# Altium schematic sheet EV75E52A_R3_4-PIC_USB.SchDoc
size Tabloid; DocumentNumber: 4; SheetNumber: 4; PageSetup: Record=PageOptions|CenterHorizontal=True|CenterVertical=True|PrintScale=1.02|XCorrection=1.00|YCorrection=1.00|PrintKind=0|BorderSize=5000000|LeftOffset=0|BottomOffset=0|Orientation=2|PaperLength=1000|PaperWidth=1000|Scale=100|PaperSource=15|PrintQuality=-3|MediaType=1|DitherType=10|PrintScaleMode=1|PaperKind=11 x 17|PaperIndex=119; PageTitle: PIC; SheetTitle: PIC; DocumentFullPathAndName: //depot_np_hweng_boards/ung_hweng/UNG_8017_EVB-USB5926/
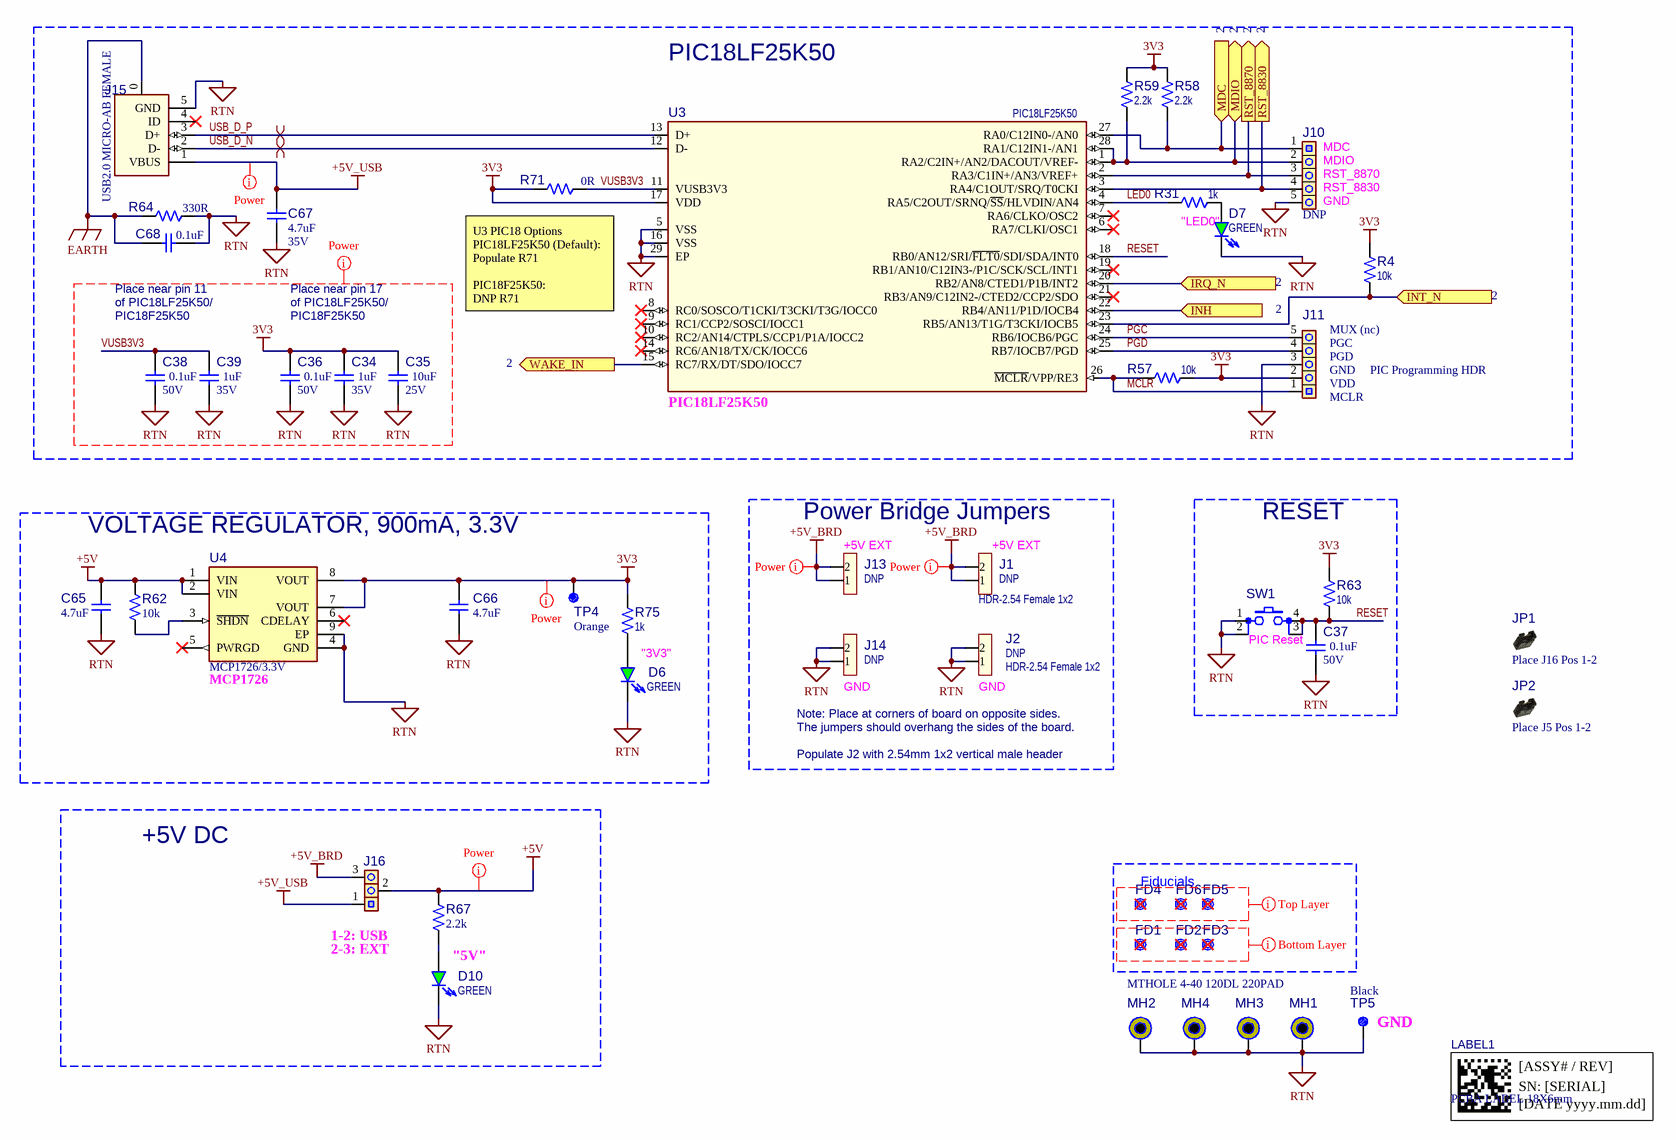
[diagram p0: EV75E52A_R3_4-PIC_USB.SchDoc]

## Parts
C34  value 1uF  Voltage: 35V  [CAP_C_0402]  (hidden comment: Capacitor NP)
C35  value 10uF  Voltage: 25V  [CAP_C_0603]  (hidden comment: Capacitor NP)
C36  value 0.1uF  Voltage: 50V  [CAP_C_0402]  (hidden comment: Capacitor NP)
C37  value 0.1uF  Voltage: 50V  [CAP_C_0402]  (hidden comment: Capacitor NP)
C38  value 0.1uF  Voltage: 50V  [CAP_C_0402]  (hidden comment: Capacitor NP)
C39  value 1uF  Voltage: 35V  [CAP_C_0402]  (hidden comment: Capacitor NP)
C65  value 4.7uF  [CAP_C_0402]  (hidden comment: Capacitor NP)
C66  value 4.7uF  [CAP_C_0402]  (hidden comment: Capacitor NP)
C67  value 4.7uF  Voltage: 35V  [CAP_C_0603]  (hidden comment: Capacitor NP)
C68  value 0.1uF  [CAP_C_0402]  (hidden comment: Capacitor NP)
D6  value GREEN  [LED_0603_GREEN]  (hidden comment: LED_green)
D7  value GREEN  [LED_0603_GREEN]  (hidden comment: LED_green)
D10  value GREEN  Legend Note: "5V"  [LED_0603_GREEN]  (hidden comment: LED_green)
FD1  FIDUCIAL ROUND  [FIDUCIAL_ROUND_1mm]  (value not drawn)  (no BOM)
FD2  FIDUCIAL ROUND  [FIDUCIAL_ROUND_1mm]  (value not drawn)  (no BOM)
FD3  FIDUCIAL ROUND  [FIDUCIAL_ROUND_1mm]  (value not drawn)  (no BOM)
FD4  FIDUCIAL ROUND  [FIDUCIAL_ROUND_1mm]  (value not drawn)  (no BOM)
FD5  FIDUCIAL ROUND  [FIDUCIAL_ROUND_1mm]  (value not drawn)  (no BOM)
FD6  FIDUCIAL ROUND  [FIDUCIAL_ROUND_1mm]  (value not drawn)  (no BOM)
J1  value HDR-2.54 Female 1x2  Populated: DNP  [HDR_F_2.54_1x2_RA]  (hidden comment: Header 1x2)
J2  value HDR-2.54 Female 1x2  Populated: DNP  [HDR_F_2.54_1x2_RA]  (hidden comment: Header 1x2)
J10  Populated: DNP  [HDR_M_2.54_1x5]  (hidden comment: Header 1x5)
J11  Header 1x5  [HDR_M_2.54_1x5]  (value not drawn)
J13  Populated: DNP  [HDR_M_2.54_1x2_RA]  (hidden comment: Header 1x2)
J14  Populated: DNP  [HDR_M_2.54_1x2_RA]  (hidden comment: Header 1x2)
J15  value USB2.0 MICRO-AB FEMALE  [CON_USB_Micro-AB_SMD_RA_HIR_ZX62-AB-5PA(11)]  (hidden comment: CON USB2.0 Mini_Micro)
J16  Header 1x3  [HDR_M_2.54_1x3]  (value not drawn)  (net tie)
JP1  BOM Notes: Place J16 Pos 1-2  [Jumper_W_Handle_Mechanical]  (hidden comment: Jumper Mechanical)  (mechanical)
JP2  BOM Notes: Place J5 Pos 1-2  [Jumper_W_Handle_Mechanical]  (hidden comment: Jumper Mechanical)  (mechanical)
LABEL1  value PCBA LABEL 18X6mm  [08-10015]  (hidden comment: 08-10015)
MH1  (no value)  [MTHOLE_4-40]  (no BOM)
MH2  (no value)  [MTHOLE_4-40]  (no BOM)
MH3  (no value)  [MTHOLE_4-40]  (no BOM)
MH4  (no value)  [MTHOLE_4-40]  (no BOM)
R4  value 10k  [RES_C_0402]  (hidden comment: Resistor)
R31  value 1k  [RES_C_0402]  (hidden comment: Resistor)
R57  value 10k  [RES_C_0402]  (hidden comment: Resistor)
R58  value 2.2k  [RES_C_0402]  (hidden comment: Resistor)
R59  value 2.2k  [RES_C_0402]  (hidden comment: Resistor)
R62  value 10k  [RES_C_0402]  (hidden comment: Resistor)
R63  value 10k  [RES_C_0402]  (hidden comment: Resistor)
R64  value 330R  [RES_C_0603]  (hidden comment: Resistor)
R67  value 2.2k  [RES_C_0603]  (hidden comment: Resistor)
R71  value 0R  [RES_C_0402]  (hidden comment: Resistor)
R75  value 1k  [RES_C_0402]  (hidden comment: Resistor)
SW1  Switch 4 Pin  [SW_TACT_SMD_CK_PTS810SJM]  (value not drawn)
TP4  value Orange  [CON_TP_TH_V_ORN_KEC_5003]  (hidden comment: Test Point)
TP5  value Black  Legend Notes: GND  [CON_TP_TH_V_BLK_KEC_5001]  (hidden comment: Test Point)
U3  value PIC18LF25K50  [QFN-28_6X6]  (hidden comment: PIC18(L)F2XK50 QFN-28)
U4  value MCP1726/3.3V  Legend Note: MCP1726  [DFN-8_3x3]  (hidden comment: MCP1726 FIX DFN-8)

## Blocks framed on the sheet
PIC18LF25K50: C34-C36 C38 C39 C67 C68 D7 J10 J11 J15 R4 R31 R57-R59 R64 R71 U3
VOLTAGE REGULATOR, 900mA, 3.3V: C65 C66 D6 R62 R75 TP4 U4
Power Bridge Jumpers: J1 J2 J13 J14
RESET: C37 R63 SW1
+5V DC: D10 J16 R67
Fiducials: FD1-FD6

## Ports
INH (in), INT_N (in), IRQ_N (in), MDC (in), MDIO (bidir), RST_8830 (out), RST_8870 (out), WAKE_IN (out)

## Nets
3V3: C34.2 C35.2 C36.2 C66.2 J11.2(P2) R4.1 R57.1 R58.2 R59.2 R63.1 R71.1 R75.2 TP4.1 U3.17(VDD) U4.7(VOUT) U4.8(VOUT)
+5V: C65.2 J16.2 R62.2 R67.1 U4.1(VIN) U4.2(VIN)
+5V_BRD: J1.1 J1.2 J13.1 J13.2 J16.3
+5V_USB: C67.2 J15.1(VBUS) J16.1
EARTH: C68.2 J15.0(SHLD) R64.2
RTN: C34.1 C35.1 C36.1 C37.1 C38.1 C39.1 C65.1 C66.1 C67.1 C68.1 D6.2(K) D7.2(K) D10.2(K) J2.1 J2.2 J10.5(P5) J11.3(P3) J14.1 J14.2 J15.5(GND) MH1.1 MH2.1 MH3.1 MH4.1 R64.1 SW1.1 SW1.2 TP5.1 U3.5(VSS) U3.16(VSS) U3.29(EP) U4.4(GND) U4.9(EP)
INH: U3.22(RB4/AN11/P1D/IOCB4) ; port INH
INT_N: R4.2 U3.23(RB5/AN13/T1G/T3CKI/IOCB5) ; port INT_N
IRQ_N: U3.20(RB2/AN8/CTED1/P1B/INT2) ; port IRQ_N
LED0: R31.2 U3.4(RA5/C2OUT/SRNQ/~{SS}/HLVDIN/AN4)
MCLR: J11.1(P1) R57.2 U3.26(~{MCLR}/VPP/RE3)
MDC: J10.1(P1) R58.1 U3.27(RA0/C12IN0-/AN0) ; port MDC
MDIO: J10.2(P2) R59.1 U3.1(RA2/C2IN+/AN2/DACOUT/VREF-) U3.28(RA1/C12IN1-/AN1) ; port MDIO
PGC: J11.5(P5) U3.24(RB6/IOCB6/PGC)
PGD: J11.4(P4) U3.25(RB7/IOCB7/PGD)
RESET: C37.2 R63.2 SW1.3 SW1.4 U3.18(RB0/AN12/SRI/~{FLT0}/SDI/SDA/INT0)
RST_8830: J10.4(P4) U3.3(RA4/C1OUT/SRQ/T0CKI) ; port RST_8830
RST_8870: J10.3(P3) U3.2(RA3/C1IN+/AN3/VREF+) ; port RST_8870
USB_D_N: J15.2(D-) U3.12(D-)
USB_D_P: J15.3(D+) U3.13(D+)
VUSB3V3: C38.2 C39.2 R71.2 U3.11(VUSB3V3)
WAKE_IN: U3.15(RC7/RX/DT/SDO/IOCC7) ; port WAKE_IN
NetD6_1: D6.1(A) R75.1
NetD7_1: D7.1(A) R31.1
NetD10_1: D10.1(A) R67.2
NetR62_1: R62.1 U4.3(~{SHDN})

Not connected (* = marked no-connect by the designer): FD1 1*; FD2 1*; FD3 1*; FD4 1*; FD5 1*; FD6 1*; J15 4(ID)*; U3 6(RA7/CLKI/OSC1)* 7(RA6/CLKO/OSC2)* 8(RC0/SOSCO/T1CKI/T3CKI/T3G/IOCC0)* 9(RC1/CCP2/SOSCI/IOCC1)* 10(RC2/AN14/CTPLS/CCP1/P1A/IOCC2)* 14(RC6/AN18/TX/CK/IOCC6)* 19(RB1/AN10/C12IN3-/P1C/SCK/SCL/INT1)* 21(RB3/AN9/C12IN2-/CTED2/CCP2/SDO)*; U4 5(PWRGD)* 6(CDELAY)*

## Layout directives
net class Power: 3V3, +5V, +5V_BRD, +5V_USB, RTN, VUSB3V3
differential pair; net class 90R: USB_D_N, USB_D_P
rule Permitted Layers Rule [Permitted Layers - Top,]: (no net found under the mark)
rule Permitted Layers Rule [Permitted Layers - Bottom]: (no net found under the mark)

## Notes on the sheet
- (near J10) MDC
- (near J10) MDIO
- (near J10) RST_8870
- (near D7) "LED0"
- (near J10) RST_8830
- (near J10) GND
- (near C68) Place near pin 11
- of PIC18LF25K50/
- PIC18F25K50
- Place near pin 17
- (near R71) U3 PIC18 Options
  PIC18LF25K50 (Default):
  Populate R71
  PIC18F25K50:
  DNP R71
- MUX (nc)
- (near J11) PGC
- (near J11) PGD
- (near J11) GND
- (near J11) VDD
- PIC Programming HDR
- (near J11) MCLR
- (near J13) +5V EXT
- (near J1) +5V EXT
- "3V3"
- (near SW1) PIC Reset
- Note: Place at corners of board on opposite sides.
- (near J14) GND
- (near J2) GND
- The jumpers should overhang the sides of the board.
- Populate J2 with 2.54mm 1x2 vertical male header
- (near J16) 1-2: USB
- 2-3: EXT
- Project Owner:
- PCB Layout Contact:
- PartNumber:
- Project Title
- Variant:
- Sheet Title
- Size
- Tabloid
- SCH #:
- PCB #:
- Rev:
- Date:
- Sheet
- Designed with
- Altium.com <http://go.altium.com/MicrochipLandingPage_Evaluation.html>
- File:
- (in symbol 08-10015) [ASSY# / REV]; SN: [SERIAL]; [DATE yyyy.mm.dd]

## Library data of the parts
C34 C39 = CAP1338: Capacitor; Manufacturer 1: Murata Electronics North America; Manufacturer Part Number 1: GRM155R6YA105KE11D; Description_: CAP CER 1uF 35V 10% X5R SMD 0402; Dev Tools Status: Design; Tolerance: 10%; Temperature Coeffcient: X5R; Type: Ceramic; Owner: Sam Charles; Populated: Yes; MCHP-ID: CAP1338; Package: 0402; Revision: A; Symbol: Capacitor NP; Status: MCL Design; ComponentLink1URL: https://chn-vm-apps.microchip.com/mchprepo/parts/Datasheets/c02e.pdf; ComponentLink1Description: SVN Datasheet; ComponentLink2URL: C:\ALTIUM_WORK\00001_MCHP-CDB\Datasheets\c02e.pdf; ComponentLink2Description: Local Datasheet; ComponentLink3URL: C:\ALTIUM_WORK\00001_MCHP-CDB\Library\LibraryRefs\Capacitor NP.SchLib; ComponentLink3Description: Open Symbol; ComponentLink4URL: C:\ALTIUM_WORK\00001_MCHP-CDB\Library\Footprints\CAP_C_0402.PcbLib; ComponentLink4Description: Open Footprint; ComponentLink5Description: Open Footprint 2; ComponentLink6Description: Open Footprint 3; ComponentLink7Description: Open Footprint 4; Operating Temperature: -55C to +85C; Category: Capacitor; Supplier 1: Digi-Key; Supplier Part Number 1: 490-10019-1-ND; Quantity Override: 1
C35 = CAP1461: Capacitor; Manufacturer 1: Murata Electronics North America; Manufacturer Part Number 1: GRM188R61E106MA73D; Description_: CAP CER 10UF 25V 20% X5R SMD 0603; Dev Tools Status: Production; Tolerance: ±20%; Temperature Coeffcient: X5R; Type: Ceramic; Owner: Tim Moffat; Populated: Yes; MCHP-ID: CAP1461; Package: 0603; Revision: 1; Symbol: Capacitor NP; Status: MCL Design; ComponentLink1URL: https://chn-vm-apps.microchip.com/mchprepo/parts/Datasheets/GRM188R61E106MA73-01.pdf; ComponentLink1Description: SVN Datasheet; ComponentLink2URL: C:\ALTIUM_WORK\00001_MCHP-CDB\Datasheets\GRM188R61E106MA73-01.pdf; ComponentLink2Description: Local Datasheet; ComponentLink3URL: C:\ALTIUM_WORK\00001_MCHP-CDB\Library\LibraryRefs\Capacitor NP.SchLib; ComponentLink3Description: Open Symbol; ComponentLink4URL: C:\ALTIUM_WORK\00001_MCHP-CDB\Library\Footprints\CAP_C_0603.PcbLib; ComponentLink4Description: Open Footprint; ComponentLink5Description: Open Footprint 2; ComponentLink6Description: Open Footprint 3; ComponentLink7Description: Open Footprint 4; Operating Temperature: -55C to 85C; Category: Capacitor; Supplier 1: Digi-Key; Supplier Part Number 1: 490-7202-1-ND; Quantity Override: 1
C36-C38 = CAP1463: Capacitor; Manufacturer 1: TDK Corporation; Manufacturer Part Number 1: C1005X7R1H104K050BB; Description_: CAP CER 0.1uF 50V 10% X7R SMD 0402; Dev Tools Status: Production; Tolerance: 10%; Temperature Coeffcient: X7R; Type: Ceramic; Owner: Jamus Griego; Populated: Yes; MCHP-ID: CAP1463; Package: 0402; Revision: 1; Symbol: Capacitor NP; Status: MCL Design; ComponentLink1URL: https://chn-vm-apps.microchip.com/mchprepo/parts/Datasheets/TDKMLCCCapRange.pdf; ComponentLink1Description: SVN Datasheet; ComponentLink2URL: C:\ALTIUM_WORK\00001_MCHP-CDB\Datasheets\TDKMLCCCapRange.pdf; ComponentLink2Description: Local Datasheet; ComponentLink3URL: C:\ALTIUM_WORK\00001_MCHP-CDB\Library\LibraryRefs\Capacitor NP.SchLib; ComponentLink3Description: Open Symbol; ComponentLink4URL: C:\ALTIUM_WORK\00001_MCHP-CDB\Library\Footprints\CAP_C_0402.PcbLib; ComponentLink4Description: Open Footprint; ComponentLink5Description: Open Footprint 2; ComponentLink6Description: Open Footprint 3; ComponentLink7Description: Open Footprint 4; Operating Temperature: -55C to +125C; Category: Capacitor; Supplier 1: Digi-Key; Supplier Part Number 1: 445-5932-1-ND; Quantity Override: 1
C65 C66 = CAP1207: Manufacturer 1: Murata; Manufacturer Part Number 1: GRM155R60J475ME47D; Voltage: 6.3V; Description_: CAP CER 4.7uF 6.3V 20% X5R SMD 0402; Dev Tools Status: Production; Tolerance: 20%; Temperature Coefficient: X5R; Type: Ceramic; Owner: Tad Ahlvers; Populated: YES; MCHP-ID: CAP1207; Package: 0402; Revision: 1; Symbol: Capacitor NP; Status: MCL Design; ComponentLink1URL: https://chn-vm-apps.microchip.com/mchprepo/parts/Datasheets/c02e.pdf; ComponentLink1Description: SVN Datasheet; ComponentLink2URL: C:\ALTIUM_WORK\00001_MCHP-CDB\Datasheets\c02e.pdf; ComponentLink2Description: Local Datasheet; ComponentLink3URL: C:\ALTIUM_WORK\00001_MCHP-CDB\Library\LibraryRefs\Capacitor NP.SchLib; ComponentLink3Description: Open Symbol; ComponentLink4URL: C:\ALTIUM_WORK\00001_MCHP-CDB\Library\Footprints\CAP_C_0402.PcbLib; ComponentLink4Description: Open Footprint; ComponentLink5Description: Open Footprint 2; ComponentLink6Description: Open Footprint 3; ComponentLink7Description: Open Footprint 4; Operating Temperature: -55C to +85C; Category: Capacitor; Manufacturer 2: TDK Corporation; Manufacturer Part Number 2: C1005X5R0J475M050BC; Supplier 1: Digi-Key; Supplier Part Number 1: 490-5915-2-ND; Supplier 2: Digi-Key; Supplier Part Number 2: 445-7395-2-ND; Quantity Override: 1
C67 = CAP1478: Capacitor; Manufacturer 1: Murata Electronics North America; Manufacturer Part Number 1: GRM188R6YA475KE15D; Description_: CAP CER 4.7uF 35V 10% X5R SMD 0603; Dev Tools Status: Design; Tolerance: 10%; Temperature Coeffcient: X5R; Type: Ceramic; Owner: Sorin Stanoaia; Populated: YES; MCHP-ID: CAP1478; Package: 0603; Revision: A; Symbol: Capacitor NP; Status: MCL Design; ComponentLink1URL: https://chn-vm-apps.microchip.com/mchprepo/parts/Datasheets/GRM188R6YA475KE15-01.pdf; ComponentLink1Description: SVN Datasheet; ComponentLink2URL: C:\ALTIUM_WORK\00001_MCHP-CDB\Datasheets\GRM188R6YA475KE15-01.pdf; ComponentLink2Description: Local Datasheet; ComponentLink3URL: C:\ALTIUM_WORK\00001_MCHP-CDB\Library\LibraryRefs\Capacitor NP.SchLib; ComponentLink3Description: Open Symbol; ComponentLink4URL: C:\ALTIUM_WORK\00001_MCHP-CDB\Library\Footprints\CAP_C_0603.PcbLib; ComponentLink4Description: Open Footprint; ComponentLink5Description: Open Footprint 2; ComponentLink6Description: Open Footprint 3; ComponentLink7Description: Open Footprint 4; Operating Temperature: -55C to +85C; Category: Capacitor; Supplier 1: Digi-Key; Supplier Part Number 1: 490-7205-1-ND; Quantity Override: 1
C68 = CAP1463: Capacitor; Manufacturer 1: TDK Corporation; Manufacturer Part Number 1: C1005X7R1H104K050BB; Voltage: 50V; Description_: CAP CER 0.1uF 50V 10% X7R SMD 0402; Dev Tools Status: Production; Tolerance: 10%; Temperature Coeffcient: X7R; Type: Ceramic; Owner: Jamus Griego; Populated: YES; MCHP-ID: CAP1463; Package: 0402; Revision: 1; Symbol: Capacitor NP; Status: MCL Design; ComponentLink1URL: https://chn-vm-apps.microchip.com/mchprepo/parts/Datasheets/TDKMLCCCapRange.pdf; ComponentLink1Description: SVN Datasheet; ComponentLink2URL: C:\ALTIUM_WORK\00001_MCHP-CDB\Datasheets\TDKMLCCCapRange.pdf; ComponentLink2Description: Local Datasheet; ComponentLink3URL: C:\ALTIUM_WORK\00001_MCHP-CDB\Library\LibraryRefs\Capacitor NP.SchLib; ComponentLink3Description: Open Symbol; ComponentLink4URL: C:\ALTIUM_WORK\00001_MCHP-CDB\Library\Footprints\CAP_C_0402.PcbLib; ComponentLink4Description: Open Footprint; ComponentLink5Description: Open Footprint 2; ComponentLink6Description: Open Footprint 3; ComponentLink7Description: Open Footprint 4; Operating Temperature: -55C to +125C; Category: Capacitor; Supplier 1: Digi-Key; Supplier Part Number 1: 445-5932-1-ND; Quantity Override: 1
D6 D7 D10 = DIODE1155: LED; Manufacturer 1: Lite-On Inc; Manufacturer Part Number 1: LTST-C191KGKT; Description_: DIO LED GREEN 2V 30mA 35mcd Clear SMD 0603; Dev Tools Status: Production; Type: LED Single; Forward Current: 30mA; Power: 75mW; Reverse Voltage: 5V; Owner: Tad Ahlvers; Populated: YES; MCHP-ID: DIODE1155; Revision: 1; Symbol: LED_green; Status: MCL Design; ComponentLink1URL: https://chn-vm-apps.microchip.com/mchprepo/parts/Datasheets/S_110_LTST-C191KGKT.pdf; ComponentLink1Description: SVN Datasheet; ComponentLink2URL: C:\ALTIUM_WORK\00001_MCHP-CDB\Datasheets\S_110_LTST-C191KGKT.pdf; ComponentLink2Description: Local Datasheet; ComponentLink3URL: C:\ALTIUM_WORK\00001_MCHP-CDB\Library\LibraryRefs\LED_green.SchLib; ComponentLink3Description: Open Symbol; ComponentLink4URL: C:\ALTIUM_WORK\00001_MCHP-CDB\Library\Footprints\LED_0603_GREEN.PcbLib; ComponentLink4Description: Open Footprint; ComponentLink5Description: Open Footprint 2; ComponentLink6Description: Open Footprint 3; ComponentLink7Description: Open Footprint 4; Operating Temperature: -55C to +85C; Category: Diode; Manufacturer 2: Ledtech; Manufacturer Part Number 2: LT8A23-54-SB96-T5; Supplier 1: Digi-Key; Supplier Part Number 1: 160-1446-1-ND; Supplier 2: Raynen; Supplier Part Number 2: LEDD00036B01; Quantity Override: 1
FD1-FD6 = MECH0254: Fiducial; Description_: FIDUCIAL ROUND PCB 1mm SMD; Dev Tools Status: Production; Owner: Cristian Papuc; Populated: MECH; MCHP-ID: MECH0254; Value: FIDUCIAL; Revision: 1; Symbol: FIDUCIAL ROUND; Status: MCL Design; ComponentLink1Description: SVN Datasheet; ComponentLink2Description: Local Datasheet; ComponentLink3URL: C:\ALTIUM_WORK\00001_MCHP-CDB\Library\LibraryRefs\FIDUCIAL ROUND.SchLib; ComponentLink3Description: Open Symbol; ComponentLink4URL: C:\ALTIUM_WORK\00001_MCHP-CDB\Library\Footprints\FIDUCIAL_ROUND_1mm.PcbLib; ComponentLink4Description: Open Footprint; ComponentLink5Description: Open Footprint 2; ComponentLink6Description: Open Footprint 3; ComponentLink7Description: Open Footprint 4; Type: Fiducial; Category: Hardware; Quantity Override: 1
J1 J2 = CON1240: Manufacturer 1: Sullins Connector Solutions; Manufacturer Part Number 1: PPPC021LGBN-RC; Description_: CON HDR-2.54 Female 1x2 Gold TH R/A; Dev Tools Status: Production; Owner: Jairuz Agang-ang; MCHP-ID: CON1240; Revision: 0; Symbol: Header 1x2; Status: MCL Design; ComponentLink1URL: https://chn-vm-apps.microchip.com/mchprepo/parts/Datasheets/78_Page80-81_HEADER_.100_2.54mm_FEMALE.pdf; ComponentLink1Description: SVN Datasheet; ComponentLink2URL: C:\ALTIUM_WORK\00001_MCHP-CDB\Datasheets\78_Page80-81_HEADER_.100_2.54mm_FEMALE.pdf; ComponentLink2Description: Local Datasheet; ComponentLink3URL: C:\ALTIUM_WORK\00001_MCHP-CDB\Library\LibraryRefs\Header 1x2.SchLib; ComponentLink3Description: Open Symbol; ComponentLink4URL: C:\ALTIUM_WORK\00001_MCHP-CDB\Library\Footprints\HDR_F_2.54_1x2_RA.PcbLib; ComponentLink4Description: Open Footprint; ComponentLink5Description: Open Footprint 2; ComponentLink6Description: Open Footprint 3; ComponentLink7Description: Open Footprint 4; Type: Header 2.54mm; Category: Connector; Supplier 1: Digi-Key; Supplier Part Number 1: S5477-ND; Quantity Override: 1
J10 = CON0416: Manufacturer 1: FCI; Manufacturer Part Number 1: 68000-105HLF; Value: HDR-2.54 Male 1x5; Description_: CON HDR-2.54 Male 1x5 Gold 5.84MH TH VERT; Dev Tools Status: Production; MCHP-ID: CON0416; Revision: 1; Symbol: Header 1x5; Status: MCL Design; ComponentLink1URL: https://chn-vm-apps.microchip.com/mchprepo/parts/Datasheets/TSW-XXX-XX-XXX-X-XX-XXX-MKT.pdf; ComponentLink1Description: SVN Datasheet; ComponentLink2URL: C:\ALTIUM_WORK\00001_MCHP-CDB\Datasheets\TSW-XXX-XX-XXX-X-XX-XXX-MKT.pdf; ComponentLink2Description: Local Datasheet; ComponentLink3URL: C:\ALTIUM_WORK\00001_MCHP-CDB\Library\LibraryRefs\Header 1x5.SchLib; ComponentLink3Description: Open Symbol; ComponentLink4URL: C:\ALTIUM_WORK\00001_MCHP-CDB\Library\Footprints\HDR_M_2.54_1x5.PcbLib; ComponentLink4Description: Open Footprint; ComponentLink5Description: Open Footprint 2; ComponentLink6Description: Open Footprint 3; ComponentLink7Description: Open Footprint 4; Type: Header 2.54mm; Category: Connector; Manufacturer 2: Samtec; Manufacturer Part Number 2: TSW-105-07-S-S; Manufacturer 3: Nextron; Manufacturer Part Number 3: 211-051A7-0021-400; Supplier 1: Digi-Key; Supplier Part Number 1: 609-3462-ND; Supplier 2: Digi-Key; Supplier Part Number 2: SAM1033-05-ND; Supplier 3: Raynen; Supplier Part Number 3: CONN00303A01M; Quantity Override: 1
J11 = CON0416: Manufacturer 1: FCI; Manufacturer Part Number 1: 68000-105HLF; Value: HDR-2.54 Male 1x5; Description_: CON HDR-2.54 Male 1x5 Gold 5.84MH TH VERT; Dev Tools Status: Production; Populated: Yes; MCHP-ID: CON0416; Revision: 1; Symbol: Header 1x5; Status: MCL Design; ComponentLink1URL: https://chn-vm-apps.microchip.com/mchprepo/parts/Datasheets/TSW-XXX-XX-XXX-X-XX-XXX-MKT.pdf; ComponentLink1Description: SVN Datasheet; ComponentLink2URL: C:\ALTIUM_WORK\00001_MCHP-CDB\Datasheets\TSW-XXX-XX-XXX-X-XX-XXX-MKT.pdf; ComponentLink2Description: Local Datasheet; ComponentLink3URL: C:\ALTIUM_WORK\00001_MCHP-CDB\Library\LibraryRefs\Header 1x5.SchLib; ComponentLink3Description: Open Symbol; ComponentLink4URL: C:\ALTIUM_WORK\00001_MCHP-CDB\Library\Footprints\HDR_M_2.54_1x5.PcbLib; ComponentLink4Description: Open Footprint; ComponentLink5Description: Open Footprint 2; ComponentLink6Description: Open Footprint 3; ComponentLink7Description: Open Footprint 4; Type: Header 2.54mm; Category: Connector; Manufacturer 2: Samtec; Manufacturer Part Number 2: TSW-105-07-S-S; Manufacturer 3: Nextron; Manufacturer Part Number 3: 211-051A7-0021-400; Supplier 1: Digi-Key; Supplier Part Number 1: 609-3462-ND; Supplier 2: Digi-Key; Supplier Part Number 2: SAM1033-05-ND; Supplier 3: Raynen; Supplier Part Number 3: CONN00303A01M; Quantity Override: 1
J13 J14 = CON1526: Manufacturer 1: Molex, LLC; Manufacturer Part Number 1: 0901210762; Value: HDR-2.54 Male 1x2; Description_: CON HDR-2.54 Male 1x2 Gold 6.75MH TH R/A; Dev Tools Status: Production; Owner: Jojie Batislaon; MCHP-ID: CON1526; Revision: 1; Symbol: Header 1x2; Status: MCL Design; ComponentLink1URL: https://chn-vm-apps.microchip.com/mchprepo/parts/Datasheets/901210762_sd.pdf; ComponentLink1Description: SVN Datasheet; ComponentLink2URL: C:\ALTIUM_WORK\00001_MCHP-CDB\Datasheets\901210762_sd.pdf; ComponentLink2Description: Local Datasheet; ComponentLink3URL: C:\ALTIUM_WORK\00001_MCHP-CDB\Library\LibraryRefs\Header 1x2.SchLib; ComponentLink3Description: Open Symbol; ComponentLink4URL: C:\ALTIUM_WORK\00001_MCHP-CDB\Library\Footprints\HDR_M_2.54_1x2_RA.PcbLib; ComponentLink4Description: Open Footprint; ComponentLink5Description: Open Footprint 2; ComponentLink6Description: Open Footprint 3; ComponentLink7Description: Open Footprint 4; Type: Header 2.54mm; Category: Connector; Manufacturer 2: Nextron; Manufacturer Part Number 2: 211-022S-7021-00; Supplier 1: Digi-Key; Supplier Part Number 1: WM8108-ND; Supplier 2: Raynen; Supplier Part Number 2: CONN00236C01M; Quantity Override: 1
J15 = CON0436: Connector USB Mini; Manufacturer 1: Hirose; Manufacturer Part Number 1: ZX62-AB-5PA(31); Description_: CON USB2.0 MICRO-AB FEMALE SMD R/A; Dev Tools Status: Production; Populated: YES; MCHP-ID: CON0436; Revision: 1; Symbol: CON USB2.0 Mini_Micro; Status: MCL Design; ComponentLink1URL: https://chn-vm-apps.microchip.com/mchprepo/parts/Datasheets/e24200011.pdf; ComponentLink1Description: Datasheet; Type: USB; Category: Connector; Supplier 1: Digi-Key; Supplier Part Number 1: H125279CT-ND; Quantity Override: 1; Manufacturer 2: Hirose; Manufacturer Part Number 2: ZX62-AB-5PA(11); Manufacturer 3: Dongguan Yang Ming Precision Plastic Hardware Electronics Co., Ltd. (ShenZhen YangMing); Manufacturer Part Number 3: YM-02-07-D-21; Supplier 2: Digi-Key; Supplier Part Number 2: H11635CT-ND; Supplier 3: Raynen; Supplier Part Number 3: PLUG00069C01M
J16 = CON1105: Manufacturer 1: FCI; Manufacturer Part Number 1: 68000-103HLF; Value: HDR-2.54 Male 1x3; Description_: CON HDR-2.54 Male 1x3 Gold 5.84MH TH VERT; Dev Tools Status: Production; Owner: Bogdan P (M91398); Populated: Yes; Restricted Sourcing: No; MCHP-ID: CON1105; Revision: 5; Symbol: Header 1x3; Status: MCL Design; ComponentLink1URL: https://chn-vm-apps.microchip.com/mchprepo/parts/Datasheets/68000.pdf; ComponentLink1Description: SVN Datasheet; ComponentLink2URL: C:\ALTIUM_WORK\00001_MCHP-CDB\Datasheets\68000.pdf; ComponentLink2Description: Local Datasheet; ComponentLink3URL: C:\ALTIUM_WORK\00001_MCHP-CDB\Library\LibraryRefs\Header 1x3.SchLib; ComponentLink3Description: Open Symbol; ComponentLink4URL: C:\ALTIUM_WORK\00001_MCHP-CDB\Library\Footprints\HDR_M_2.54_1x3.PcbLib; ComponentLink4Description: Open Footprint; ComponentLink5Description: Open Footprint 2; ComponentLink6Description: Open Footprint 3; ComponentLink7Description: Open Footprint 4; Type: Header 2.54mm; Category: Connector; Manufacturer 2: SHENZHEN JUNHAO ENGINEERING; Manufacturer Part Number 2: R-211-0311-0021-000; Manufacturer 3: Shanghai NS-TECH; Manufacturer Part Number 3: NS-201-SH0100-1*3; Supplier 1: Digi-Key; Supplier Part Number 1: 609-3461-ND; Supplier 2: SHENZHEN JUNHAO ENGINEERING; Supplier Part Number 2: R-211-0311-0021-000; Supplier 3: Shanghai NS-TECH; Supplier Part Number 3: NS-201-SH0100-1*3; Quantity Override: 1
JP1 JP2 = HW1008: Manufacturer 1: TE Connectivity AMP Connectors; Manufacturer Part Number 1: 880584-4; MCHP-ID: HW1008; Value: Shunt 2.54mm 1x2 Handle; Description_: MECH HW JUMPER 2.54mm 1x2 w/ Handle; Dev Tools Status: Production; Owner: Jairuz Agang-ang; Populated: MECH; Revision: 1; Symbol: Jumper Mechanical; Status: MCL Design; ComponentLink1URL: https://chn-vm-apps.microchip.com/mchprepo/parts/Datasheets/152671.pdf; ComponentLink1Description: SVN Datasheet; ComponentLink2URL: C:\ALTIUM_WORK\00001_MCHP-CDB\Datasheets\152671.pdf; ComponentLink2Description: Local Datasheet; ComponentLink3URL: C:\ALTIUM_WORK\00001_MCHP-CDB\Library\LibraryRefs\Jumper Mechanical.SchLib; ComponentLink3Description: Open Symbol; ComponentLink4URL: C:\ALTIUM_WORK\00001_MCHP-CDB\Library\Footprints\Jumper_W_Handle_Mechanical.PcbLib; ComponentLink4Description: Open Footprint; ComponentLink5Description: Open Footprint 2; ComponentLink6Description: Open Footprint 3; ComponentLink7Description: Open Footprint 4; Type: Jumper; Category: Hardware; Manufacturer 2: Jameco; Manufacturer Part Number 2: 152671; Supplier 1: Digi-Key; Supplier Part Number 1: A122487-ND; Supplier 2: Jameco; Supplier Part Number 2: 152671; Quantity Override: 1
MH1 MH3 MH4 = MTHOLE 4-40 120DL 220PAD: Revision: 0; Description_: MTHOLE 4-40 120DL 220PAD; DNP: DNP
MH2 = MTHOLE 4-40 120DL 220PAD: Populated: Yes; Revision: 0; Description_: MTHOLE 4-40 120DL 220PAD
R4 R57 R63 = RSMT0439: Manufacturer 1: Vishay; Manufacturer Part Number 1: CRCW040210K0JNED; Tolerance: 5%; Description_: RES TKF 10k 5% 1/16W SMD 0402; Dev Tools Status: Production; Voltage: 50V; Temperature Coeffcient: 100ppm/C; Power: 1/16W; Populated: Yes; MCHP-ID: RSMT0439; Package: 0402; Revision: 1; Symbol: Resistor; Status: MCL Design; ComponentLink1URL: https://chn-vm-apps.microchip.com/mchprepo/parts/Datasheets/PYu-RC0402_51_RoHS_L_6.pdf; ComponentLink1Description: SVN Datasheet; ComponentLink2URL: C:\ALTIUM_WORK\00001_MCHP-CDB\Datasheets\PYu-RC0402_51_RoHS_L_6.pdf; ComponentLink2Description: Local Datasheet; ComponentLink3URL: C:\ALTIUM_WORK\00001_MCHP-CDB\Library\LibraryRefs\Resistor.SchLib; ComponentLink3Description: Open Symbol; ComponentLink4URL: C:\ALTIUM_WORK\00001_MCHP-CDB\Library\Footprints\RES_C_0402.PcbLib; ComponentLink4Description: Open Footprint; ComponentLink5Description: Open Footprint 2; ComponentLink6Description: Open Footprint 3; ComponentLink7Description: Open Footprint 4; Operating Temperature: -55C to +155C; Category: Resistor; Type: RES SMD; Composition: TKF; Manufacturer 2: Yageo; Manufacturer Part Number 2: RC0402JR-0710KL; Supplier 1: Digi-Key; Supplier Part Number 1: 541-10KJCT-ND; Supplier 2: Digi-Key; Supplier Part Number 2: 311-10KJRCT-ND; Quantity Override: 1
R31 = RES1663: Manufacturer 1: Yageo; Manufacturer Part Number 1: RT0402BRD071KL; Tolerance: 0.1%; Description_: RES TF 1k 0.1% 1/16W SMD 0402; Dev Tools Status: Design; Voltage: 50V; Temperature Coeffcient: 25ppm/C; Power: 1/16W; Owner: Jose Garcia; Populated: YES; MCHP-ID: RES1663; Package: 0402; Revision: A; Symbol: Resistor; Status: MCL Design; ComponentLink1URL: https://chn-vm-apps.microchip.com/mchprepo/parts/Datasheets/PYu-RT_1-to-0.01_RoHS_L_8.pdf; ComponentLink1Description: SVN Datasheet; ComponentLink2URL: C:\ALTIUM_WORK\00001_MCHP-CDB\Datasheets\PYu-RT_1-to-0.01_RoHS_L_8.pdf; ComponentLink2Description: Local Datasheet; ComponentLink3URL: C:\ALTIUM_WORK\00001_MCHP-CDB\Library\LibraryRefs\Resistor.SchLib; ComponentLink3Description: Open Symbol; ComponentLink4URL: C:\ALTIUM_WORK\00001_MCHP-CDB\Library\Footprints\RES_C_0402.PcbLib; ComponentLink4Description: Open Footprint; ComponentLink5Description: Open Footprint 2; ComponentLink6Description: Open Footprint 3; ComponentLink7Description: Open Footprint 4; Operating Temperature: -55C to +155C; Category: Resistor; Type: RES SMD; Composition: TF; Supplier 1: Digi-Key; Supplier Part Number 1: YAG1386CT-ND; Quantity Override: 1
R58 R59 = RES1023: Manufacturer 1: Panasonic; Manufacturer Part Number 1: ERJ-2RKF2201X; Tolerance: 1%; Description_: RES TKF 2.2k 1% 1/10W SMD 0402; Dev Tools Status: Production; Voltage: 50V; Temperature Coeffcient: 100ppm/C; Power: 1/10W; Owner: Tad Ahlvers; Populated: YES; MCHP-ID: RES1023; Package: 0402; Revision: 1; Symbol: Resistor; Status: MCL Design; ComponentLink1URL: https://chn-vm-apps.microchip.com/mchprepo/parts/Datasheets/AOA0000CE2.pdf; ComponentLink1Description: SVN Datasheet; ComponentLink2URL: C:\ALTIUM_WORK\00001_MCHP-CDB\Datasheets\AOA0000CE2.pdf; ComponentLink2Description: Local Datasheet; ComponentLink3URL: C:\ALTIUM_WORK\00001_MCHP-CDB\Library\LibraryRefs\Resistor.SchLib; ComponentLink3Description: Open Symbol; ComponentLink4URL: C:\ALTIUM_WORK\00001_MCHP-CDB\Library\Footprints\RES_C_0402.PcbLib; ComponentLink4Description: Open Footprint; ComponentLink5Description: Open Footprint 2; ComponentLink6Description: Open Footprint 3; ComponentLink7Description: Open Footprint 4; Operating Temperature: -55C to +155C; Category: Resistor; Type: RES SMD; Composition: TKF; Supplier 1: Digi-Key; Supplier Part Number 1: P2.20KLTR-ND; Quantity Override: 1
R62 = RSMT1019: Manufacturer 1: Panasonic; Manufacturer Part Number 1: ERJ-2RKF1002X; Tolerance: 1%; Description_: RES TKF 10k 1% 1/10W SMD 0402; Dev Tools Status: Production; Voltage: 50V; Power: 1/10W; Owner: Brent Lanphear; Populated: Yes; Temperature Coefficient: 100ppm/C; MCHP-ID: RSMT1019; Package: 0402; Revision: 2; Symbol: Resistor; Status: MCL Design; ComponentLink1URL: https://chn-vm-apps.microchip.com/mchprepo/parts/Datasheets/AOA0000CE2.pdf; ComponentLink1Description: SVN Datasheet; ComponentLink2URL: C:\ALTIUM_WORK\00001_MCHP-CDB\Datasheets\AOA0000CE2.pdf; ComponentLink2Description: Local Datasheet; ComponentLink3URL: C:\ALTIUM_WORK\00001_MCHP-CDB\Library\LibraryRefs\Resistor.SchLib; ComponentLink3Description: Open Symbol; ComponentLink4URL: C:\ALTIUM_WORK\00001_MCHP-CDB\Library\Footprints\RES_C_0402.PcbLib; ComponentLink4Description: Open Footprint; ComponentLink5Description: Open Footprint 2; ComponentLink6Description: Open Footprint 3; ComponentLink7Description: Open Footprint 4; Operating Temperature: -55C to +155C; Category: Resistor; Type: RES SMD; Composition: TKF; Quantity Override: 1; Supplier 1: Digi-Key; Supplier Part Number 1: P10.0KLCT-ND; Supplier 2: Mouser; Supplier Part Number 2: 667-ERJ-2RKF1002X
R64 = RSMT0626: Manufacturer 1: Panasonic; Manufacturer Part Number 1: ERJ-3EKF3300V; Tolerance: 1%; Description_: RES TKF 330R 1% 1/10W SMD 0603; Dev Tools Status: Production; Voltage: 75V; Temperature Coeffcient: 100ppm/C; Power: 1/10W; Populated: Yes; MCHP-ID: RSMT0626; Package: 0603; Revision: 2; Symbol: Resistor; Status: MCL Design; ComponentLink1URL: https://chn-vm-apps.microchip.com/mchprepo/parts/Datasheets/AOA0000CE2.pdf; ComponentLink1Description: SVN Datasheet; ComponentLink2URL: C:\ALTIUM_WORK\00001_MCHP-CDB\Datasheets\AOA0000CE2.pdf; ComponentLink2Description: Local Datasheet; ComponentLink3URL: C:\ALTIUM_WORK\00001_MCHP-CDB\Library\LibraryRefs\Resistor.SchLib; ComponentLink3Description: Open Symbol; ComponentLink4URL: C:\ALTIUM_WORK\00001_MCHP-CDB\Library\Footprints\RES_C_0603.PcbLib; ComponentLink4Description: Open Footprint; ComponentLink5Description: Open Footprint 2; ComponentLink6Description: Open Footprint 3; ComponentLink7Description: Open Footprint 4; Operating Temperature: -55C to +155C; Category: Resistor; Type: RES SMD; Composition: TKF; Manufacturer 2: Stackpole Electronics Inc; Manufacturer Part Number 2: RMCF0603FT330R; Supplier 1: Digi-Key; Supplier Part Number 1: P330HCT-ND; Supplier 2: Digi-Key; Supplier Part Number 2: RMCF0603FT330RCT-ND; Quantity Override: 1
R67 = RES1130: Manufacturer 1: Panasonic; Manufacturer Part Number 1: ERJ-3EKF2201V; Description_: RES TKF 2.2k 1% 1/10W SMD 0603; Dev Tools Status: Production; Voltage: 75V; Temperature Coeffcient: 100ppm/C; Power: 1/10W; Owner: Bogdan P (M91398); Populated: Yes; MCHP-ID: RES1130; Revision: 0; Symbol: Resistor; Status: MCL Design; ComponentLink1URL: https://chn-vm-apps.microchip.com/mchprepo/parts/Datasheets/AOA0000CE2.pdf; ComponentLink1Description: Datasheet; Operating Temperature: -55C to +155C; Category: Resistor; Type: RES SMD; Composition: TKF; Supplier 1: Digi-Key; Supplier Part Number 1: P2.20KHCT-ND; Quantity Override: 1
R71 = RSMT0730: Manufacturer 1: Panasonic; Manufacturer Part Number 1: ERJ-2GE0R00X; Description_: RES TKF 0R SMD 0402 AEC-Q200; Dev Tools Status: Production; Populated: YES; MCHP-ID: RSMT0730; Package: 0402; Revision: 2; Symbol: Resistor; Status: MCL Design; ComponentLink1URL: https://chn-vm-apps.microchip.com/mchprepo/parts/Datasheets/AOA0000CE1.pdf; ComponentLink1Description: SVN Datasheet; ComponentLink2URL: C:\ALTIUM_WORK\00001_MCHP-CDB\Datasheets\AOA0000CE1.pdf; ComponentLink2Description: Local Datasheet; ComponentLink3URL: C:\ALTIUM_WORK\00001_MCHP-CDB\Library\LibraryRefs\Resistor.SchLib; ComponentLink3Description: Open Symbol; ComponentLink4URL: C:\ALTIUM_WORK\00001_MCHP-CDB\Library\Footprints\RES_C_0402.PcbLib; ComponentLink4Description: Open Footprint; ComponentLink5Description: Open Footprint 2; ComponentLink6Description: Open Footprint 3; ComponentLink7Description: Open Footprint 4; Operating Temperature: -55C to +155C; Category: Resistor; Type: RES SMD; Composition: TKF; Manufacturer 2: Vishay; Manufacturer Part Number 2: CRCW04020000Z0ED; Supplier 1: digikey; Supplier Part Number 1: P0.0JCT-ND; Supplier 2: digikey; Supplier Part Number 2: 541-0.0JTR-ND; Quantity Override: 1
R75 = RES1663: Manufacturer 1: Yageo; Manufacturer Part Number 1: RT0402BRD071KL; Tolerance: 0.1%; Description_: RES TF 1k 0.1% 1/16W SMD 0402; Dev Tools Status: Design; Voltage: 50V; Temperature Coeffcient: 25ppm/C; Power: 1/16W; Owner: Jose Garcia; Populated: Yes; MCHP-ID: RES1663; Package: 0402; Revision: A; Symbol: Resistor; Status: MCL Design; ComponentLink1URL: https://chn-vm-apps.microchip.com/mchprepo/parts/Datasheets/PYu-RT_1-to-0.01_RoHS_L_8.pdf; ComponentLink1Description: SVN Datasheet; ComponentLink2URL: C:\ALTIUM_WORK\00001_MCHP-CDB\Datasheets\PYu-RT_1-to-0.01_RoHS_L_8.pdf; ComponentLink2Description: Local Datasheet; ComponentLink3URL: C:\ALTIUM_WORK\00001_MCHP-CDB\Library\LibraryRefs\Resistor.SchLib; ComponentLink3Description: Open Symbol; ComponentLink4URL: C:\ALTIUM_WORK\00001_MCHP-CDB\Library\Footprints\RES_C_0402.PcbLib; ComponentLink4Description: Open Footprint; ComponentLink5Description: Open Footprint 2; ComponentLink6Description: Open Footprint 3; ComponentLink7Description: Open Footprint 4; Operating Temperature: -55C to +155C; Category: Resistor; Type: RES SMD; Composition: TF; Supplier 1: Digi-Key; Supplier Part Number 1: YAG1386CT-ND; Quantity Override: 1
SW1 = SWITCH1072: Switch; Manufacturer 1: C&K Components; Manufacturer Part Number 1: PTS810 SJM 250 SMTR LFS; Value: SPST-NO; Description_: SWITCH TACT SPST 16V 50mA  PTS810 SJM 250 SMTR LFS SMD; Dev Tools Status: Design; Owner: Sam Charles; Voltage: 16V; Current: 50mA; Populated: YES; MCHP-ID: SWITCH1072; Revision: B; Symbol: Switch 4 Pin; Status: MCL Design; ComponentLink1URL: https://chn-vm-apps.microchip.com/mchprepo/parts/Datasheets/pts810.pdf; ComponentLink1Description: SVN Datasheet; ComponentLink2URL: C:\ALTIUM_WORK\00001_MCHP-CDB\Datasheets\pts810.pdf; ComponentLink2Description: Local Datasheet; ComponentLink3URL: C:\ALTIUM_WORK\00001_MCHP-CDB\Library\LibraryRefs\Switch 4 Pin.SchLib; ComponentLink3Description: Open Symbol; ComponentLink4URL: C:\ALTIUM_WORK\00001_MCHP-CDB\Library\Footprints\SW_TACT_SMD_CK_PTS810SJM.PcbLib; ComponentLink4Description: Open Footprint; ComponentLink5Description: Open Footprint 2; ComponentLink6Description: Open Footprint 3; ComponentLink7Description: Open Footprint 4; Operating Temperature: -40°C ~ 85°C; Category: Switch; Type: Tactile; Supplier 1: Digi-Key; Supplier Part Number 1: CKN10502CT-ND; Quantity Override: 1
TP4 = CON1282: Manufacturer 1: Keystone Electronics; Manufacturer Part Number 1: 5003; Description_: CON TP LOOP Orange TH; Dev Tools Status: Design; Owner: Stephen Humberd; Populated: YES; MCHP-ID: CON1282; Revision: A; Symbol: Test Point; Status: MCL Design; ComponentLink1URL: https://chn-vm-apps.microchip.com/mchprepo/parts/Datasheets/5000-5004.PDF; ComponentLink1Description: SVN Datasheet; ComponentLink2URL: C:\ALTIUM_WORK\00001_MCHP-CDB\Datasheets\5000-5004.PDF; ComponentLink2Description: Local Datasheet; ComponentLink3URL: C:\ALTIUM_WORK\00001_MCHP-CDB\Library\LibraryRefs\Test Point.SchLib; ComponentLink3Description: Open Symbol; ComponentLink4URL: C:\ALTIUM_WORK\00001_MCHP-CDB\Library\Footprints\CON_TP_TH_V_ORN_KEC_5003.PcbLib; ComponentLink4Description: Open Footprint; ComponentLink5Description: Open Footprint 2; ComponentLink6Description: Open Footprint 3; ComponentLink7Description: Open Footprint 4; Type: Test Point; Category: Connector; Supplier 1: Digi-Key; Supplier Part Number 1: 5003K-ND; Quantity Override: 1
TP5 = MISC0026: Manufacturer 1: Keystone; Manufacturer Part Number 1: 5001; Description_: MISC, TEST POINT MULTI PURPOSE MINI BLACK; Dev Tools Status: Production; Owner: Stephen Humberd; Populated: YES; MCHP-ID: MISC0026; Revision: 0; Symbol: Test Point; Status: MCL Design; ComponentLink1URL: https://chn-vm-apps.microchip.com/mchprepo/parts/Datasheets/5000-5004.PDF; ComponentLink1Description: SVN Datasheet; ComponentLink2URL: C:\ALTIUM_WORK\00001_MCHP-CDB\Datasheets\5000-5004.PDF; ComponentLink2Description: Local Datasheet; ComponentLink3URL: C:\ALTIUM_WORK\00001_MCHP-CDB\Library\LibraryRefs\Test Point.SchLib; ComponentLink3Description: Open Symbol; ComponentLink4URL: C:\ALTIUM_WORK\00001_MCHP-CDB\Library\Footprints\CON_TP_TH_V_BLK_KEC_5001.PcbLib; ComponentLink4Description: Open Footprint; ComponentLink5Description: Open Footprint 2; ComponentLink6Description: Open Footprint 3; ComponentLink7Description: Open Footprint 4; Type: Test Point; Category: Connector; Supplier 1: Digi-Key; Supplier Part Number 1: 36-5001-ND; Quantity Override: 1
U3 = MIC6120: Manufacturer 1: Microchip Technology; Manufacturer Part Number 1: PIC18LF25K50-I/ML; Description_: MCHP MCU 8-BIT 48MHz 32kB 2kB PIC18LF25K50-I/ML QFN-28; MAPS Description: 32 KB Flash, 2048 bytes RAM, 48 MHz Int. Osc w/ Clock Recovery, 25 I/0,; Dev Tools Status: Production; Owner: Jairuz Agang-ang; MPC: LECG27M4XL05; LeadContent: Pb-FREE; TempRange: -40C to +85C; Stage: REL; PackageWidth: 6x6x0.9mm; PackingMedia: TUBE; ForceMinOrderQtyMult: False; MinOrderQty: 0; LeadCount: 28; Program Memory KBytes: 32; Program Memory KWords: 16; Ram: 2048; EEPROM: 256; IOPins: 25; MaxSpeed: 48; OscillatorMHz: 16 MHz; Comparators: 2; ADC Channels: 14; ADCBit: 10; DAChannels: 1; Populated: Yes; MCHP-ID: MIC6120; Symbol: PIC18(L)F2XK50 QFN-28; Type: 8-Bit; Status: MCL Design; Revision: 1; Category: MCHP-Microcontroller; ComponentLink1URL: http://www.microchip.com/wwwproducts/Devices.aspx?product=PIC18F25K50; ComponentLink1Description: SVN Datasheet; ComponentLink2URL: C:\ALTIUM_WORK\00001_MCHP-CDB\Datasheets\30684A.pdf; ComponentLink2Description: Local Datasheet; ComponentLink3URL: C:\ALTIUM_WORK\00001_MCHP-CDB\Library\LibraryRefs\PIC18(L)F2XK50 QFN-28.SchLib; ComponentLink3Description: Open Symbol; ComponentLink4URL: C:\ALTIUM_WORK\00001_MCHP-CDB\Library\Footprints\QFN-28_6X6.PcbLib; ComponentLink4Description: Open Footprint; ComponentLink5Description: Open Footprint 2; ComponentLink6Description: Open Footprint 3; ComponentLink7Description: Open Footprint 4; Supplier 1: Microchip Technology; Supplier Part Number 1: PIC18LF25K50-I/ML; IntroductionDate: 2012-08-31; PackageType: QFN; Family: High Perf. 8-bit; USART: 1; SPI: 1; I2C: 1; CAN: 0; USBChannels: 1; Input Capture: 0; PWM Channels: 0; mtrlcntrlpwmchannels: 2; SMPS PWM Channels: 2; QEI Channels: 0; SegmentLCD: 0; CapTouchCH: 14; DigitalTimerQty_8bit: 2; DigitalTimerQty_16bit: 2; DigitalTimerQty_32bit: 0; Quantity Override: 1; Legend Note: PIC18LF25K50
U4 = MIC2613: LDO; Manufacturer 1: Microchip; Manufacturer Part Number 1: MCP1726T-3302E/MF; Description_: MCHP ANALOG LDO 3.3V MCP1726T-3302E/MF DFN-8; Dev Tools Status: Production; Populated: Yes; MCHP-ID: MIC2613; Symbol: MCP1726 FIX DFN-8; Type: LDO; Status: MCL Design; Revision: 0; Category: MCHP-Analog; ComponentLink1URL: https://www.microchip.com/sitesearch/search/Product%20and%20Development%20Tools/MCP1726T-3302E/MF; ComponentLink1Description: SVN Datasheet; ComponentLink2Description: Local Datasheet; ComponentLink3URL: C:\ALTIUM_WORK\00001_MCHP-CDB\Library\LibraryRefs\MCP1726 FIX DFN-8.SchLib; ComponentLink3Description: Open Symbol; ComponentLink4URL: C:\ALTIUM_WORK\00001_MCHP-CDB\Library\Footprints\DFN-8_3x3.PcbLib; ComponentLink4Description: Open Footprint; ComponentLink5Description: Open Footprint 2; ComponentLink6Description: Open Footprint 3; ComponentLink7Description: Open Footprint 4; Manufacturer 2: Microchip; Manufacturer Part Number 2: MCP1726-3302E/MF; Supplier 1: Microchip; Supplier Part Number 1: MCP1726T-3302E/MF; Supplier 2: Microchip; Supplier Part Number 2: MCP1726-3302E/MF; Operating Temperature: -40C to +125C; Quantity Override: 1
LABEL1 = 08-10015: MCHP-ID: 08-10015